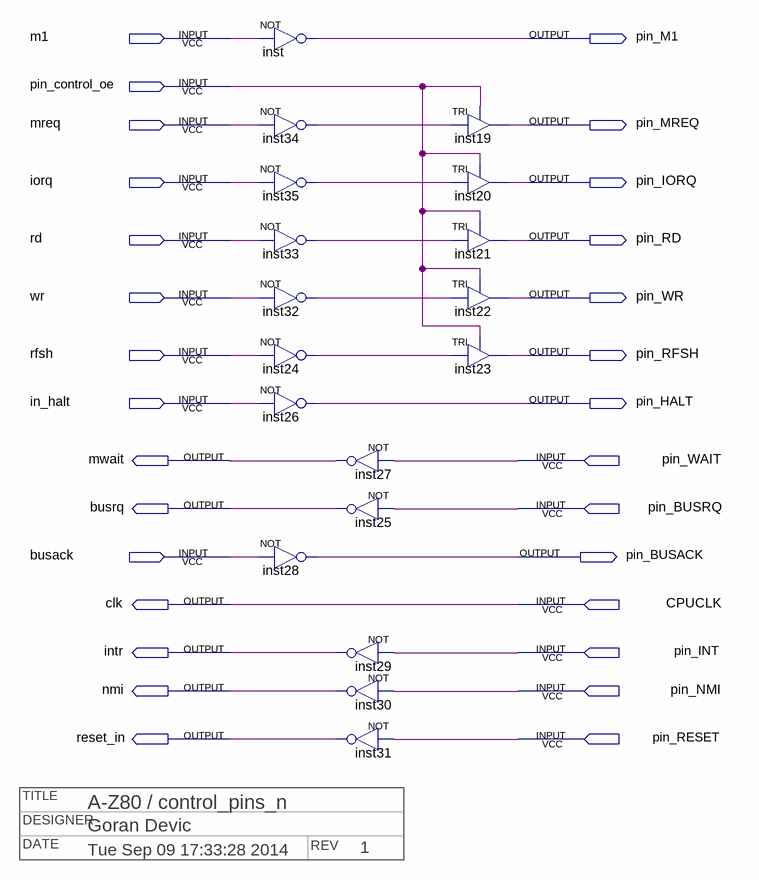
[diagram p0: schematic sheet]
// Quartus schematic control_pins_n.bdf as structural Verilog: 18 symbols, 29 pins
// Title block: TITLE: A-Z80 / control_pins_n; DESIGNER: Goran Devic; DATE: Tue Sep 09 17:33:28 2014; REV: 1
module control_pins_n (
  input  m1,
  input  pin_control_oe,
  input  mreq,
  input  iorq,
  input  rd,
  input  wr,
  input  rfsh,
  input  in_halt,
  input  pin_WAIT,
  input  pin_BUSRQ,
  input  busack,
  input  CPUCLK,
  input  pin_INT,
  input  pin_NMI,
  input  pin_RESET,
  output pin_M1,
  output pin_MREQ,
  output pin_IORQ,
  output pin_RD,
  output pin_WR,
  output pin_RFSH,
  output pin_HALT,
  output mwait,
  output busrq,
  output pin_BUSACK,
  output clk,
  output intr,
  output nmi,
  output reset_in
);

  wire inst24_out, inst32_out, inst33_out, inst34_out, inst35_out;

  not inst (pin_M1, m1);
  not inst34 (inst34_out, mreq);
  not inst35 (inst35_out, iorq);
  not inst33 (inst33_out, rd);
  not inst32 (inst32_out, wr);
  not inst24 (inst24_out, rfsh);
  not inst26 (pin_HALT, in_halt);
  not inst28 (pin_BUSACK, busack);
  not inst27 (mwait, pin_WAIT);
  not inst25 (busrq, pin_BUSRQ);
  not inst29 (intr, pin_INT);
  not inst30 (nmi, pin_NMI);
  not inst31 (reset_in, pin_RESET);
  TRI inst19 (.IN(inst34_out), .OE(pin_control_oe), .OUT(pin_MREQ));
  TRI inst20 (.IN(inst35_out), .OE(pin_control_oe), .OUT(pin_IORQ));
  TRI inst21 (.IN(inst33_out), .OE(pin_control_oe), .OUT(pin_RD));
  TRI inst22 (.IN(inst32_out), .OE(pin_control_oe), .OUT(pin_WR));
  TRI inst23 (.IN(inst24_out), .OE(pin_control_oe), .OUT(pin_RFSH));

  assign clk = CPUCLK;
endmodule
